# EAGLE design M900dec (EAGLE 6.6.0)
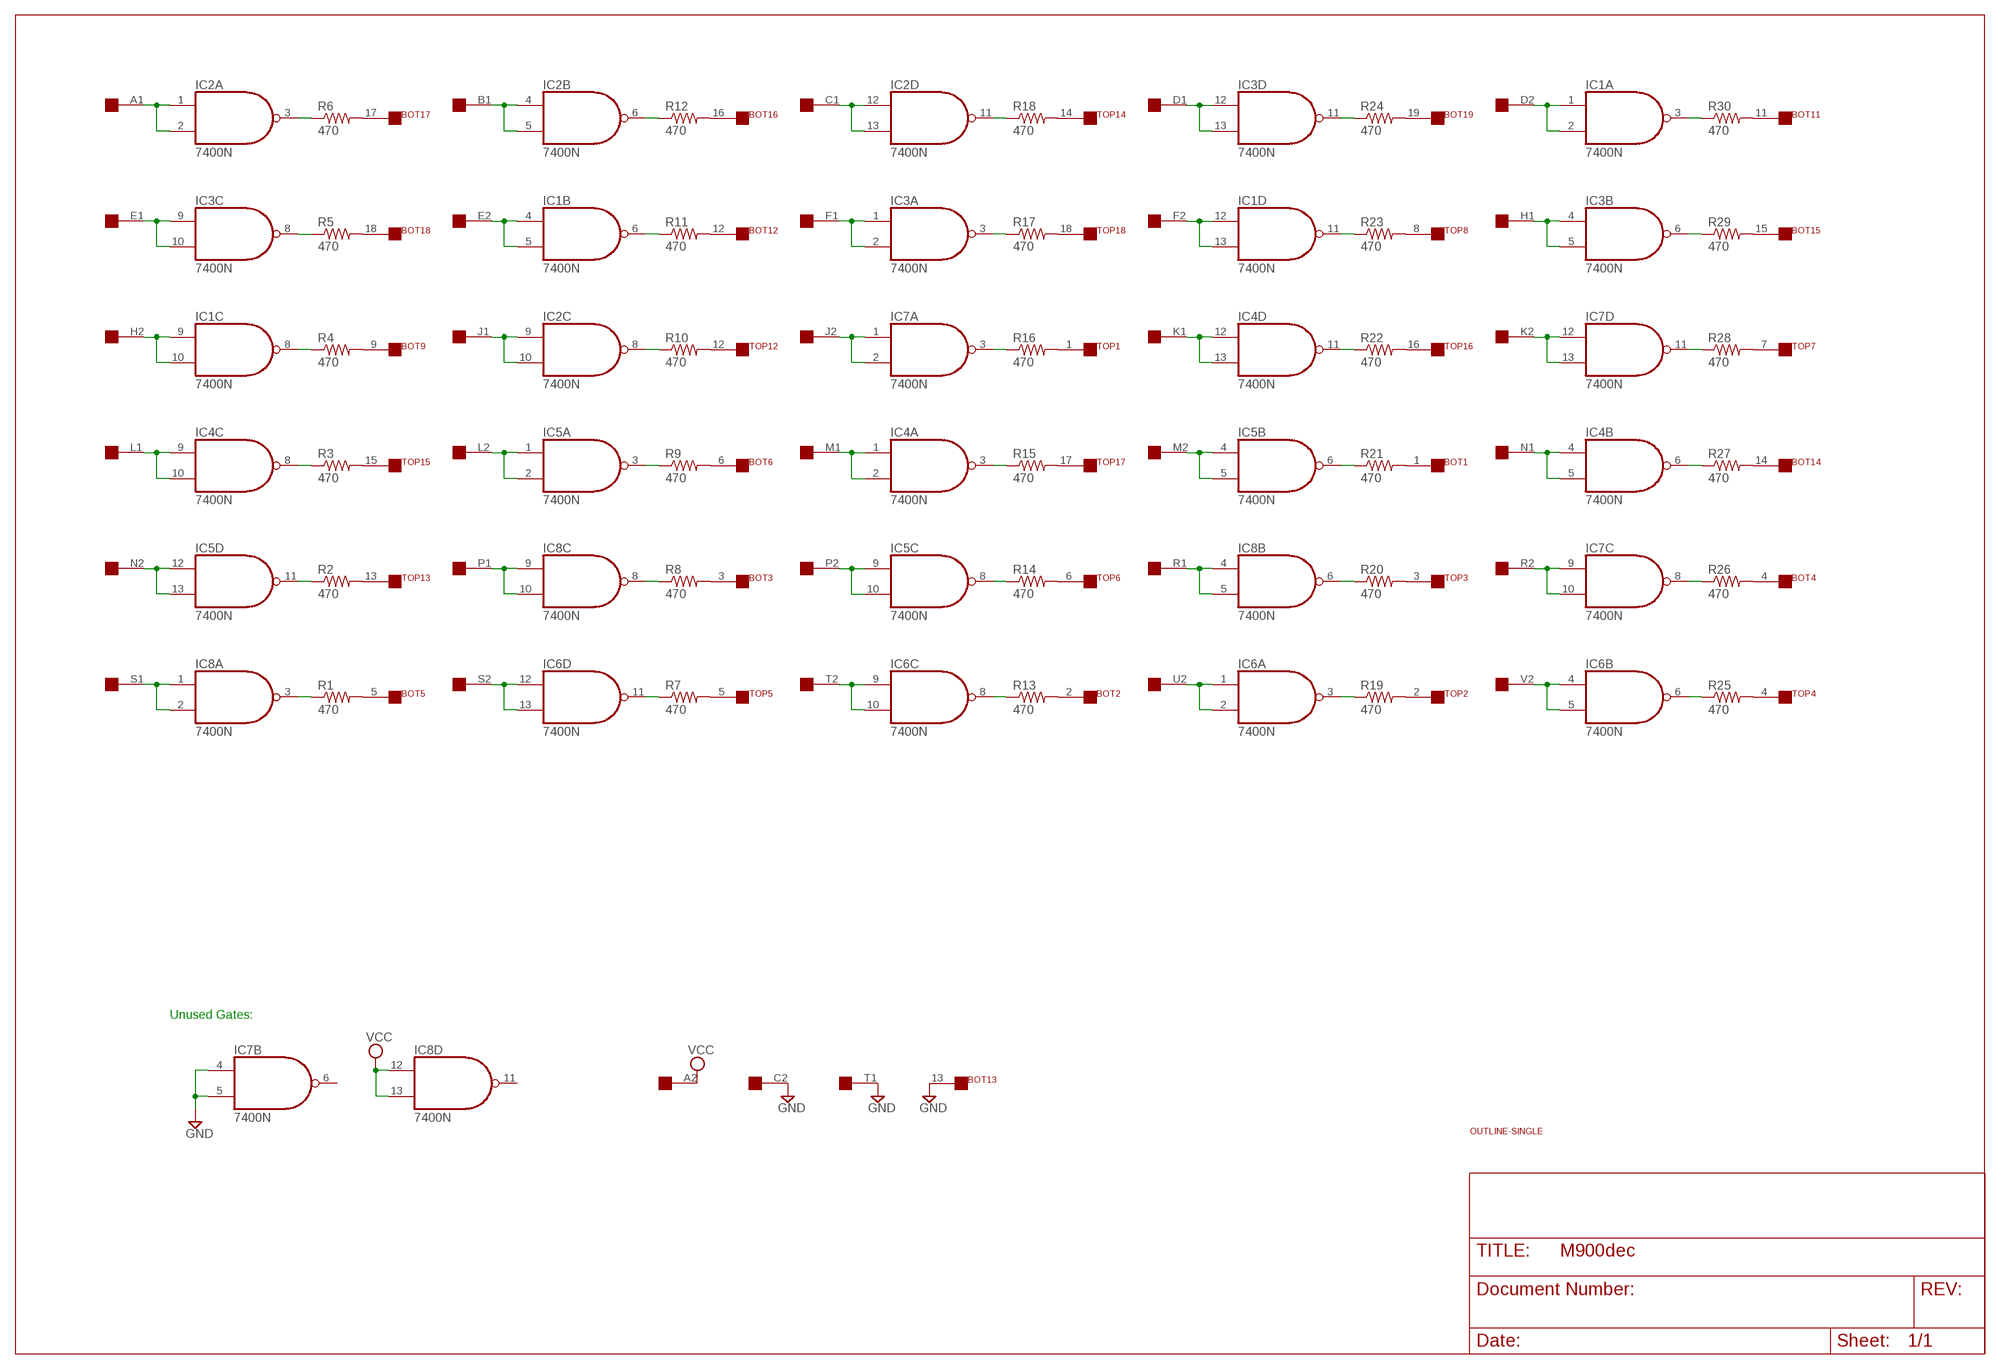
[diagram p0: schematic, sheet 1]

## Parts
BOT  FLEX19  [FLEX19]
EDGE  SINGLE  [EDGE-CON2]
IC1  7400N  [DIL14]
IC2  7400N  [DIL14]
IC3  7400N  [DIL14]
IC4  7400N  [DIL14]
IC5  7400N  [DIL14]
IC6  7400N  [DIL14]
IC7  7400N  [DIL14]
IC8  7400N  [DIL14]
R1  470  R-US_0207/10  [0207/10]
R2  470  R-US_0207/10  [0207/10]
R3  470  R-US_0207/10  [0207/10]
R4  470  R-US_0207/10  [0207/10]
R5  470  R-US_0207/10  [0207/10]
R6  470  R-US_0207/10  [0207/10]
R7  470  R-US_0207/10  [0207/10]
R8  470  R-US_0207/10  [0207/10]
R9  470  R-US_0207/10  [0207/10]
R10  470  R-US_0207/10  [0207/10]
R11  470  R-US_0207/10  [0207/10]
R12  470  R-US_0207/10  [0207/10]
R13  470  R-US_0207/10  [0207/10]
R14  470  R-US_0207/10  [0207/10]
R15  470  R-US_0207/10  [0207/10]
R16  470  R-US_0207/10  [0207/10]
R17  470  R-US_0207/10  [0207/10]
R18  470  R-US_0207/10  [0207/10]
R19  470  R-US_0207/10  [0207/10]
R20  470  R-US_0207/10  [0207/10]
R21  470  R-US_0207/10  [0207/10]
R22  470  R-US_0207/10  [0207/10]
R23  470  R-US_0207/10  [0207/10]
R24  470  R-US_0207/10  [0207/10]
R25  470  R-US_0207/10  [0207/10]
R26  470  R-US_0207/10  [0207/10]
R27  470  R-US_0207/10  [0207/10]
R28  470  R-US_0207/10  [0207/10]
R29  470  R-US_0207/10  [0207/10]
R30  470  R-US_0207/10  [0207/10]
TOP  FLEX19  [FLEX19]
U$2  OUTLINE-SINGLE  [SINGLE]

## Nets
GND: BOT.13 EDGE.C2 EDGE.T1 IC7.4(B:I0) IC7.5(B:I1)
N$1: EDGE.A1 IC2.1(A:I0) IC2.2(A:I1)
N$2: IC2.3(A:O) R6.1
N$3: IC3.8(C:O) R5.1
N$4: IC1.8(C:O) R4.1
N$5: IC4.8(C:O) R3.1
N$6: IC5.11(D:O) R2.1
N$7: EDGE.H2 IC1.9(C:I0) IC1.10(C:I1)
N$8: EDGE.S1 IC8.1(A:I0) IC8.2(A:I1)
N$9: EDGE.N2 IC5.12(D:I0) IC5.13(D:I1)
N$10: EDGE.L1 IC4.9(C:I0) IC4.10(C:I1)
N$11: EDGE.E1 IC3.9(C:I0) IC3.10(C:I1)
N$12: EDGE.P1 IC8.9(C:I0) IC8.10(C:I1)
N$13: EDGE.B1 IC2.4(B:I0) IC2.5(B:I1)
N$14: EDGE.E2 IC1.4(B:I0) IC1.5(B:I1)
N$15: EDGE.J1 IC2.9(C:I0) IC2.10(C:I1)
N$16: EDGE.L2 IC5.1(A:I0) IC5.2(A:I1)
N$17: EDGE.S2 IC6.12(D:I0) IC6.13(D:I1)
N$18: IC8.8(C:O) R8.1
N$19: IC5.3(A:O) R9.1
N$20: IC2.8(C:O) R10.1
N$21: IC1.6(B:O) R11.1
N$22: IC2.6(B:O) R12.1
N$23: IC6.11(D:O) R7.1
N$24: IC8.3(A:O) R1.1
N$25: EDGE.P2 IC5.9(C:I0) IC5.10(C:I1)
N$26: EDGE.C1 IC2.12(D:I0) IC2.13(D:I1)
N$27: EDGE.F1 IC3.1(A:I0) IC3.2(A:I1)
N$28: EDGE.J2 IC7.1(A:I0) IC7.2(A:I1)
N$29: EDGE.M1 IC4.1(A:I0) IC4.2(A:I1)
N$30: EDGE.T2 IC6.9(C:I0) IC6.10(C:I1)
N$31: IC6.8(C:O) R13.1
N$32: IC5.8(C:O) R14.1
N$33: IC4.3(A:O) R15.1
N$34: IC7.3(A:O) R16.1
N$35: IC2.11(D:O) R18.1
N$36: IC3.3(A:O) R17.1
N$37: IC6.3(A:O) R19.1
N$38: IC8.6(B:O) R20.1
N$39: IC5.6(B:O) R21.1
N$40: IC4.11(D:O) R22.1
N$41: IC1.11(D:O) R23.1
N$42: IC3.11(D:O) R24.1
N$43: EDGE.R1 IC8.4(B:I0) IC8.5(B:I1)
N$44: EDGE.F2 IC1.12(D:I0) IC1.13(D:I1)
N$45: EDGE.K1 IC4.12(D:I0) IC4.13(D:I1)
N$46: EDGE.M2 IC5.4(B:I0) IC5.5(B:I1)
N$47: EDGE.U2 IC6.1(A:I0) IC6.2(A:I1)
N$48: EDGE.R2 IC7.9(C:I0) IC7.10(C:I1)
N$49: EDGE.D1 IC3.12(D:I0) IC3.13(D:I1)
N$50: EDGE.D2 IC1.1(A:I0) IC1.2(A:I1)
N$51: EDGE.H1 IC3.4(B:I0) IC3.5(B:I1)
N$52: EDGE.K2 IC7.12(D:I0) IC7.13(D:I1)
N$53: EDGE.N1 IC4.4(B:I0) IC4.5(B:I1)
N$54: EDGE.V2 IC6.4(B:I0) IC6.5(B:I1)
N$55: IC6.6(B:O) R25.1
N$56: IC7.8(C:O) R26.1
N$57: IC4.6(B:O) R27.1
N$58: IC7.11(D:O) R28.1
N$59: IC3.6(B:O) R29.1
N$60: IC1.3(A:O) R30.1
N$61: R17.2 TOP.18
N$62: R15.2 TOP.17
N$63: R22.2 TOP.16
N$64: R3.2 TOP.15
N$65: R18.2 TOP.14
N$66: R2.2 TOP.13
N$67: R10.2 TOP.12
N$68: R23.2 TOP.8
N$69: R28.2 TOP.7
N$70: R14.2 TOP.6
N$71: R7.2 TOP.5
N$72: R25.2 TOP.4
N$73: R20.2 TOP.3
N$74: R19.2 TOP.2
N$75: R16.2 TOP.1
N$76: BOT.15 R29.2
N$77: BOT.3 R8.2
N$78: BOT.1 R21.2
N$79: BOT.2 R13.2
N$80: BOT.4 R26.2
N$81: BOT.5 R1.2
N$82: BOT.19 R24.2
N$83: BOT.18 R5.2
N$84: BOT.17 R6.2
N$85: BOT.16 R12.2
N$86: BOT.14 R27.2
N$87: BOT.12 R11.2
N$88: BOT.9 R4.2
N$89: BOT.6 R9.2
N$90: BOT.11 R30.2
VCC: EDGE.A2 IC8.12(D:I0) IC8.13(D:I1)
Unconnected: BOT.7 BOT.8 BOT.10 EDGE.B2 EDGE.U1 EDGE.V1 IC7.6(B:O) IC8.11(D:O) TOP.9 TOP.10 TOP.11 TOP.19

## Notes on the sheet
- Unused Gates:

## Power pins joined to a net without a drawn wire
GND: IC1.7(P:GND) IC2.7(P:GND) IC3.7(P:GND) IC4.7(P:GND) IC5.7(P:GND) IC6.7(P:GND) IC7.7(P:GND) IC8.7(P:GND)
VCC: IC1.14(P:VCC) IC2.14(P:VCC) IC3.14(P:VCC) IC4.14(P:VCC) IC5.14(P:VCC) IC6.14(P:VCC) IC7.14(P:VCC) IC8.14(P:VCC)

## Library data of the parts
BOT TOP = dec-con:FLEX19: 19 pin Flexprint Connection
EDGE = dec-con:SINGLE: Single-Height DEC board
IC1-IC8 = 74xx-us:74*00: Quad 2-input NAND gate
R1-R30 = rcl:R-US_: RESISTOR, American symbol
U$2 = dec-con:OUTLINE-*: Board outlines for DEC boards.

## Net classes
1 Supply: width 0.762 mm

## Board
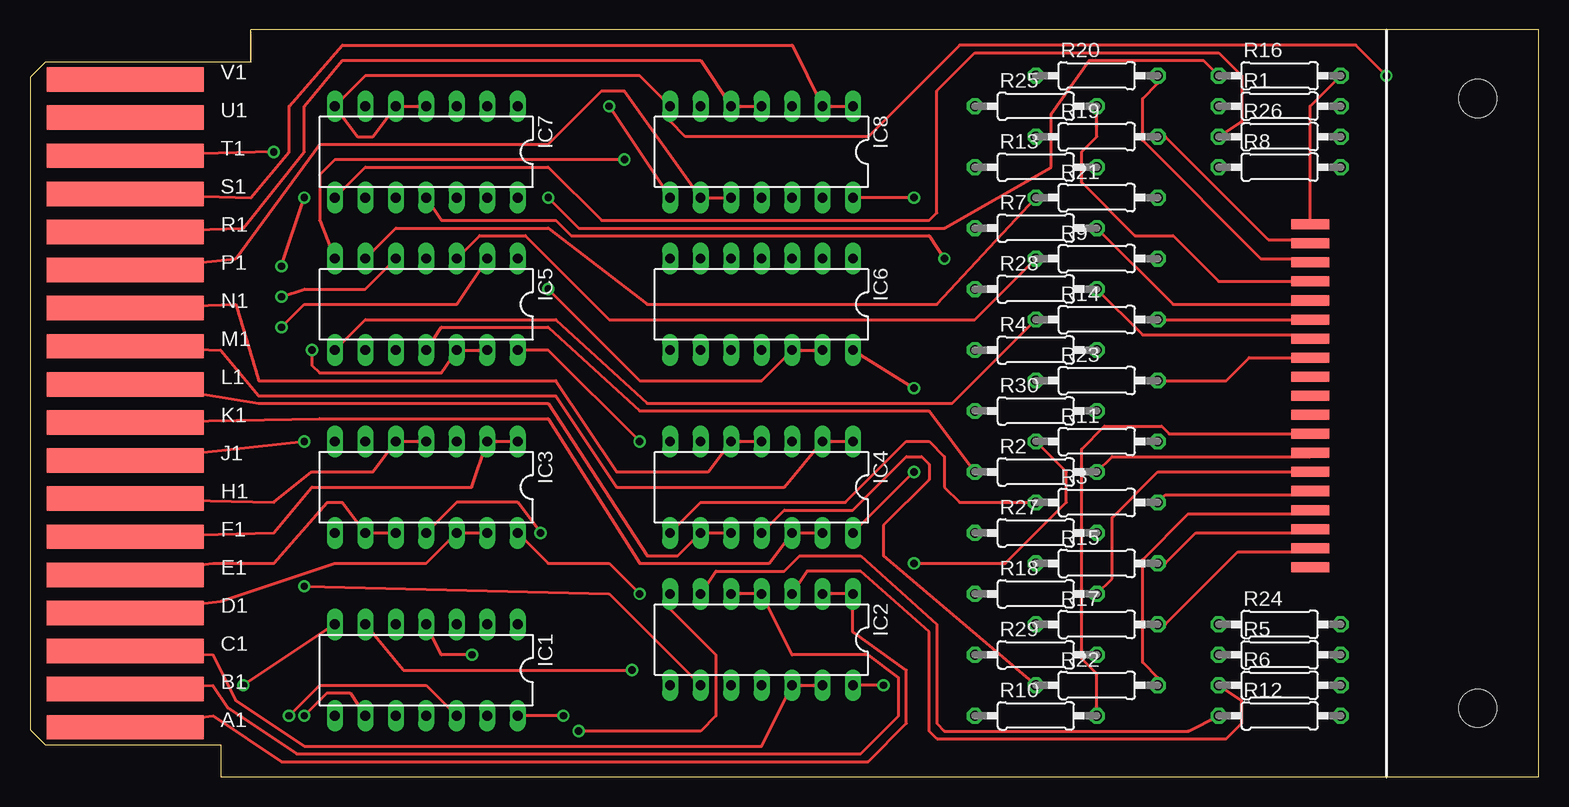
[diagram p1: board, top side]
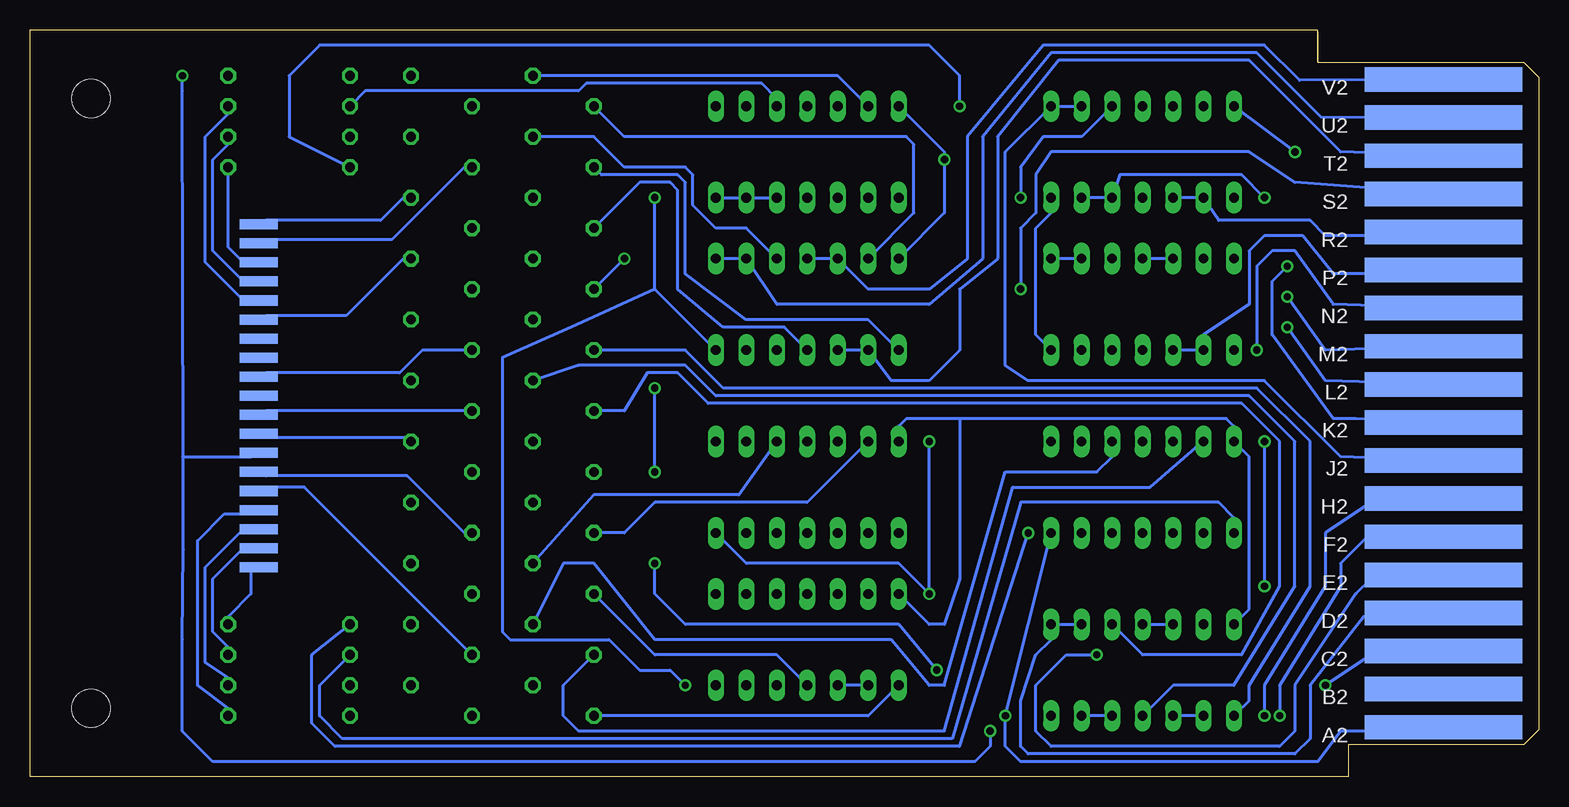
[diagram p2: board, bottom side, seen from below]

Size 125.73 x 62.23 mm. Coordinates in mm from the lower left corner, seen from the top.
Copper layers (1*16): Top 0.035mm / dielectric 1.5mm / Bottom 0.035mm
Design rules "10mils *": minimum track width 10mil, minimum drill 24mil, track to track 10mil, track to pad 10mil, pad to pad 10mil, via to via 10mil, smd to smd 10mil, copper to edge 15mil, drill to drill 10mil, minimum pad ring 10mil, minimum via ring 8mil, stop-mask expansion 0mil, vias tented up to drill 0mil, thermal gap 10mil

### Footprints (pad centres in the part's own frame; a part is rotated, then mirrored left to right if it is on the bottom)
FLEX19 = smd 3.175 x 0.838: 1 0,14.287; 2 0,12.7; 3 0,11.113; 4 0,9.525; 5 0,7.938; 6 0,6.35; 7 0,4.763; 8 0,3.175; 9 0,1.587; 10 0,0; 11 0,-1.587; 12 0,-3.175; 13 0,-4.763; 14 0,-6.35; 15 0,-7.938; 16 0,-9.525; 17 0,-11.113; 18 0,-12.7; 19 0,-14.287
EDGE-CON2 = smd 13.106 x 2.032: A1 7.938,4.128; B1 7.938,7.303; C1 7.938,10.477; D1 7.938,13.652; E1 7.938,16.828; F1 7.938,20.003; H1 7.938,23.177; J1 7.938,26.352; K1 7.938,29.527; L1 7.938,32.703; M1 7.938,35.877; N1 7.938,39.053; P1 7.938,42.227; R1 7.938,45.403; S1 7.938,48.578; T1 7.938,51.752; U1 7.938,54.928; V1 7.938,58.102 | smd 13.106 x 2.032 bottom: A2 7.938,4.128; B2 7.938,7.303; C2 7.938,10.477; D2 7.938,13.652; E2 7.938,16.828; F2 7.938,20.003; H2 7.938,23.177; J2 7.938,26.352; K2 7.938,29.527; L2 7.938,32.703; M2 7.938,35.877; N2 7.938,39.053; P2 7.938,42.227; R2 7.938,45.403; S2 7.938,48.578; T2 7.938,51.752; U2 7.938,54.928; V2 7.938,58.102
DIL14 = drill 0.813 long: 1 -7.62,-3.81; 2 -5.08,-3.81; 3 -2.54,-3.81; 4 0,-3.81; 5 2.54,-3.81; 6 5.08,-3.81; 7 7.62,-3.81; 8 7.62,3.81; 9 5.08,3.81; 10 2.54,3.81; 11 0,3.81; 12 -2.54,3.81; 13 -5.08,3.81; 14 -7.62,3.81
0207/10 = drill 0.813 octagon: 1 -5.08,0; 2 5.08,0
SINGLE = hole 3.175: 120.65,56.515; 120.65,5.715

### Placement (x,y rotation side)
BOT  106.68,31.75 0 bottom
EDGE  0,0 0 top
IC1  33.02,8.89 180 top
IC2  60.96,11.43 180 top
IC3  33.02,24.13 180 top
IC4  60.96,24.13 180 top
IC5  33.02,39.37 180 top
IC6  60.96,39.37 180 top
IC7  33.02,52.07 180 top
IC8  60.96,52.07 180 top
R1  104.14,55.88 0 top
R2  83.82,25.4 0 top
R3  88.9,22.86 0 top
R4  83.82,35.56 0 top
R5  104.14,10.16 0 top
R6  104.14,7.62 0 top
R7  83.82,45.72 0 top
R8  104.14,50.8 0 top
R9  88.9,43.18 0 top
R10  83.82,5.08 0 top
R11  88.9,27.94 0 top
R12  104.14,5.08 0 top
R13  83.82,50.8 0 top
R14  88.9,38.1 0 top
R15  88.9,17.78 0 top
R16  104.14,58.42 0 top
R17  88.9,12.7 0 top
R18  83.82,15.24 0 top
R19  88.9,53.34 0 top
R20  88.9,58.42 0 top
R21  88.9,48.26 0 top
R22  88.9,7.62 0 top
R23  88.9,33.02 0 top
R24  104.14,12.7 0 top
R25  83.82,55.88 0 top
R26  104.14,53.34 0 top
R27  83.82,20.32 0 top
R28  83.82,40.64 0 top
R29  83.82,10.16 0 top
R30  83.82,30.48 0 top
TOP  106.68,31.75 0 top
U$2  0,0 0 top

### Tracks (layer width: path | path; a pad name or v marks a point on that pad's centre or on a via)
GND  (via drill 0.61)
  Top 0.254: v17.78,7.62 IC1.7 | v20.32,52.07 EDGE.T1 | IC7.4 IC7.5 28.58,53.34 27.31,53.34 IC7.7 27.94,58.42 50.8,58.42 IC8.7 53.34,54.61 54.61,53.34 69.85,53.34 77.47,60.96 110.49,60.96 v113.03,58.42 | IC5.7 24.13,46.35 24.13,50.16 25.4,51.44 v49.53,51.44 | v45.72,3.81 55.88,3.81 57.15,5.08 57.15,10.16 53.34,13.97 IC2.7
  Bottom 0.254: v17.78,7.62 13.97,10.16 EDGE.C2 | IC1.7 24.13,13.97 24.13,26.67 IC3.7 25.4,29.21 26.04,29.84 48.26,29.84 | IC7.7 v20.32,52.07 | 48.26,29.84 52.71,29.84 53.34,29.21 IC4.7 | IC2.7 50.8,12.7 49.53,12.7 48.26,16.51 48.26,29.84 | IC6.7 49.53,46.99 v49.53,51.44 49.53,52.07 IC8.7 | v45.72,3.81 45.72,2.54 46.99,1.27 110.49,1.27 113.03,3.81 113.03,11.43 112.95,18.95 112.97,26.67 | v113.03,58.42 113.03,57.15 112.97,26.67 | BOT.13 107.32,26.67 113.03,26.67 112.97,26.67
N$1
  Top 0.254: EDGE.A1 15.24,5.08 20.96,1.27 69.85,1.27 73.03,4.45 73.03,8.89 68.58,12.06 IC2.1 IC2.2
N$2
  Top 0.254: IC2.3 64.77,17.14 69.22,17.14 74.93,12.06 74.93,3.81 75.57,3.17 99.7,3.17 100.97,4.45 100.97,6.35 R6.1
N$3
  Bottom 0.254: IC3.8 25.4,21.59 26.67,22.86 43.18,22.86 48.9,3.17 99.7,3.17 101.6,5.08 101.6,7.62 R5.1
N$4
  Bottom 0.254: IC1.8 24.13,6.35 24.13,7.62 19.05,15.88 19.05,27.94 23.5,32.38 67.95,32.38 71.12,35.56 R4.1
N$5
  Top 0.254: IC4.8 55.88,22.86 67.95,22.86 73.03,27.94 74.93,27.94 76.2,26.67 76.2,24.13 77.47,22.86 R3.1
N$6
  Top 0.254: IC5.11 34.29,37.47 43.18,37.47 50.8,30.48 74.93,30.48 R2.1
N$7  (via drill 0.61)
  Top 0.254: v22.86,5.08 24.77,6.99 26.67,6.99 IC1.9
  Bottom 0.254: EDGE.H2 13.97,22.86 17.78,20.32 17.78,15.88 22.86,7.62 v22.86,5.08 | IC1.9 IC1.10
N$8
  Top 0.254: EDGE.S1 18.42,48.26 21.59,52.07 21.59,55.88 26.04,60.96 63.5,60.96 IC8.2 IC8.1
N$9  (via drill 0.61)
  Top 0.254: IC5.13 IC5.12 34.29,33.66 24.13,33.66 23.5,34.29 v23.5,35.56
  Bottom 0.254: EDGE.N2 17.15,39.37 20.32,43.81 22.23,43.81 23.5,42.55 v23.5,35.56
N$10
  Top 0.254: IC4.10 IC4.9 53.98,18.41 51.44,18.41 43.18,31.11 19.05,31.11 7.62,33.02 EDGE.L1
N$11
  Top 0.254: IC3.10 IC3.9 26.04,22.86 24.77,22.86 20.32,17.78 15.24,17.78 EDGE.E1
N$12
  Top 0.254: IC8.10 IC8.9 49.53,57.15 47.63,57.15 43.18,52.7 24.13,52.7 17.15,43.18 EDGE.P1
N$13
  Top 0.254: EDGE.B1 15.24,7.62 16.51,5.71 22.23,1.91 69.22,1.91 72.39,5.08 72.39,8.26 69.85,10.16 63.5,10.16 IC2.4 IC2.5
N$14  (via drill 0.61)
  Top 0.254: v36.83,10.16 34.29,10.16 IC1.4
  Bottom 0.254: EDGE.E2 13.97,16.51 15.24,15.24 20.32,7.62 20.32,3.81 21.59,2.54 40.64,2.54 41.91,3.81 41.91,7.62 39.37,10.16 v36.83,10.16 | IC1.4 IC1.5
N$15  (via drill 0.61)
  Top 0.254: EDGE.J1 v22.86,27.94 | v22.86,15.88 48.26,15.24 IC2.9
  Bottom 0.254: v22.86,27.94 v22.86,15.88 | IC2.9 IC2.10
N$16  (via drill 0.61)
  Top 0.254: v20.96,37.47 22.86,39.37 35.56,39.37 IC5.2
  Bottom 0.254: EDGE.L2 17.78,33.02 v20.96,37.47 | IC5.2 IC5.1
N$17  (via drill 0.61)
  Top 0.254: v43.18,40.64 50.8,33.02 60.96,33.02 IC6.12 IC6.13
  Bottom 0.254: EDGE.S2 20.32,49.53 24.13,52.07 40.64,52.07 41.91,50.16 41.91,46.99 43.18,45.72 v43.18,40.64
N$18  (via drill 0.61)
  Top 0.254: IC8.8 v48.26,55.88
  Bottom 0.254: v48.26,55.88 48.26,58.42 50.8,60.96 101.6,60.96 104.14,58.42 104.14,53.34 R8.1
N$19
  Top 0.254: IC5.3 37.47,45.09 41.28,45.09 48.26,38.1 78.74,38.1 R9.1
N$20
  Bottom 0.254: IC2.8 55.88,5.08 R10.1
N$21  (via drill 0.61)
  Top 0.254: IC1.6 31.12,8.89 v50.17,8.89 | v73.66,17.78 81.28,17.78 86.36,22.86 86.36,25.4 R11.1
  Bottom 0.254: v50.17,8.89 53.34,12.7 71.12,12.7 73.66,15.24 v73.66,17.78
N$22
  Top 0.254: IC2.6 57.15,17.14 62.87,17.14 64.14,18.41 69.22,18.41 75.57,12.7 75.57,4.45 76.2,3.81 96.52,3.81 R12.1
N$23
  Bottom 0.254: IC6.11 62.87,37.47 67.95,37.47 71.76,40.64 71.76,48.9 72.39,49.53 74.93,49.53 R7.1
N$24
  Bottom 0.254: IC8.3 63.5,56.52 64.77,57.78 79.38,57.78 80.01,57.15 97.79,57.15 R1.1
N$25
  Bottom 0.254: EDGE.P2 13.97,41.91 17.15,41.91 19.69,45.09 22.86,45.09 24.13,43.81 24.13,39.37 27.94,36.83 IC5.9 IC5.10
N$26
  Top 0.254: EDGE.C1 15.24,10.16 17.15,6.35 22.86,2.54 60.96,2.54 IC2.12 IC2.13
N$27
  Top 0.254: IC3.1 IC3.2 36.83,24.13 23.5,24.13 20.32,20.32 EDGE.F1
N$28
  Bottom 0.254: EDGE.J2 16.51,26.67 22.86,33.02 42.55,33.02 44.45,34.29 44.45,52.07 IC7.1 IC7.2
N$29
  Top 0.254: EDGE.M1 15.88,35.56 19.05,31.75 43.82,31.75 48.9,24.13 62.87,24.13 IC4.2 IC4.1
N$30
  Bottom 0.254: EDGE.T2 16.51,52.07 24.13,59.69 40.01,59.69 45.09,53.34 45.09,43.18 48.26,40.64 48.26,35.56 50.8,33.02 53.98,33.02 IC6.9 IC6.10
N$31
  Bottom 0.254: IC6.8 55.88,38.1 66.04,38.1 71.12,41.91 71.12,49.53 71.76,50.16 78.11,50.16 R13.1
N$32
  Top 0.254: IC5.8 27.94,38.1 43.82,38.1 51.44,31.11 76.84,31.11 R14.1
N$33
  Bottom 0.254: IC4.3 66.68,23.5 78.74,23.5 R15.1
N$34  (via drill 0.61)
  Top 0.254: v43.18,48.26 45.72,45.72 76.2,45.72 85.09,50.8 85.09,55.24 88.27,59.69 97.79,59.69 R16.1
  Bottom 0.254: IC7.3 38.1,53.34 41.28,53.34 43.18,50.8 v43.18,48.26
N$35
  Bottom 0.254: IC2.11 63.5,10.16 73.66,10.16 R18.1
N$36
  Bottom 0.254: IC3.3 35.56,26.67 36.83,25.4 44.45,25.4 49.53,7.62 50.8,7.62 53.98,11.43 73.66,11.43 78.74,17.78 81.28,17.78 R17.1
N$37
  Bottom 0.254: IC6.3 66.04,45.72 68.58,45.72 70.49,47.62 70.49,50.16 71.12,50.8 76.2,50.8 78.74,53.34 R19.1
N$38
  Bottom 0.254: IC8.6 58.42,58.42 R20.1
N$39
  Top 0.254: IC5.6 30.48,45.72 43.18,45.72 51.44,39.37 75.57,39.37 R21.1
N$40
  Top 0.254: IC4.11 62.87,22.23 68.58,22.23 73.03,26.67 74.3,26.67 74.93,26.04 74.93,24.77 71.12,20.95 71.12,18.41 R22.1
N$41
  Bottom 0.254: IC1.11 30.48,7.62 25.4,7.62 20.32,15.88 20.32,27.94 24.13,31.75 68.58,31.75 71.12,34.29 80.01,34.29 R23.1
N$42  (via drill 0.61)
  Top 0.254: IC3.11 35.56,22.86 40.64,22.86 v42.55,20.32
  Bottom 0.254: v42.55,20.32 48.26,2.54 100.33,2.54 102.24,4.45 102.24,10.16 R24.1
N$43
  Top 0.254: EDGE.R1 17.78,45.72 22.86,52.07 22.86,55.88 26.04,59.69 55.88,59.69 IC8.5 IC8.4
N$44  (via drill 0.61)
  Top 0.254: IC1.12 33.02,7.62 24.13,7.62 v21.59,5.08
  Bottom 0.254: EDGE.F2 13.97,20.32 16.51,17.78 16.51,15.88 21.59,7.62 v21.59,5.08 | IC1.12 IC1.13
N$45
  Top 0.254: EDGE.K1 24.13,29.84 43.18,29.84 50.8,17.78 61.6,17.78 IC4.12 IC4.13
N$46  (via drill 0.61)
  Top 0.254: v20.96,40.01 22.86,40.64 27.94,40.64 IC5.5
  Bottom 0.254: EDGE.M2 17.78,35.56 v20.96,40.01 | IC5.5 IC5.4
N$47
  Bottom 0.254: EDGE.U2 18.14,54.97 23.5,60.33 40.64,60.33 46.36,53.34 46.36,43.18 50.8,39.37 63.5,39.37 IC6.2 IC6.1
N$48
  Bottom 0.254: EDGE.R2 13.97,45.09 17.78,45.09 19.05,46.35 26.67,46.35 IC7.9 IC7.10
N$49
  Top 0.254: IC3.13 IC3.12 33.02,17.78 25.4,17.78 15.88,14.61 EDGE.D1
N$50
  Bottom 0.254: EDGE.D2 13.34,13.34 14.61,13.34 19.05,7.62 19.05,3.17 20.32,1.91 42.55,1.91 43.18,2.54 43.18,6.35 41.91,10.16 40.64,11.43 IC1.1 IC1.2
N$51
  Top 0.254: EDGE.H1 20.32,22.86 23.5,25.4 28.58,25.4 IC3.5 IC3.4
N$52  (via drill 0.61)
  Top 0.254: v20.96,42.55 v22.86,48.26
  Bottom 0.254: IC7.13 IC7.12 34.93,50.16 24.77,50.16 v22.86,48.26 | EDGE.K2 15.24,29.84 17.15,29.84 22.23,36.83 22.23,41.27 v20.96,42.55
N$53
  Top 0.254: EDGE.N1 17.15,39.37 19.05,33.02 43.82,33.02 48.9,25.4 56.52,25.4 IC4.5 IC4.4
N$54
  Bottom 0.254: EDGE.V2 19.93,58.03 22.86,60.96 41.28,60.96 47.63,53.34 47.63,43.18 50.8,40.64 55.88,40.64 IC6.5 IC6.4
N$55
  Bottom 0.254: IC6.6 52.07,46.99 52.07,52.7 52.71,53.34 76.2,53.34 R25.1
N$56
  Top 0.254: IC7.8 27.94,50.8 43.18,50.8 47.63,46.35 74.93,46.35 75.57,46.99 75.57,57.15 78.74,60.33 99.06,60.33 100.97,58.42 100.97,54.61 R26.1
N$57
  Bottom 0.254: IC4.6 60.96,22.86 73.66,22.86 76.2,20.32 R27.1
N$58  (via drill 0.61)
  Top 0.254: IC7.11 34.29,46.35 43.82,46.35 45.09,45.09 74.93,45.09 v76.2,43.18
  Bottom 0.254: v76.2,43.18 R28.1
N$59
  Bottom 0.254: IC3.6 32.39,24.13 43.82,24.13 49.53,3.81 80.01,3.81 81.28,5.08 81.28,7.62 R29.1
N$60
  Bottom 0.254: IC1.3 33.02,10.16 24.77,10.16 21.59,15.88 21.59,27.94 24.77,31.11 69.22,31.11 71.76,33.66 74.3,33.66 76.2,30.48 R30.1
N$61
  Top 0.254: TOP.18 106.05,18.73 100.65,18.73 94.62,12.7 R17.2
N$62
  Top 0.254: TOP.17 106.05,20.32 97.16,20.32 94.62,17.78 R15.2
N$63
  Top 0.254: TOP.16 106.05,21.91 96.52,21.91 92.71,18.1 92.71,9.53 93.98,8.26 R22.2
N$64
  Top 0.254: TOP.15 106.05,23.5 94.62,23.5 R3.2
N$65
  Top 0.254: TOP.14 93.98,25.4 90.17,21.59 90.17,16.51 R18.2
N$66
  Top 0.254: R2.2 90.17,26.67 106.68,26.67 TOP.13
N$67
  Top 0.254: R10.2 88.9,8.57 87.63,9.84 87.63,27.3 89.54,29.21 94.3,29.21 94.93,28.57 TOP.12
N$68
  Top 0.254: TOP.8 101.6,34.92 99.7,33.02 R23.2
N$69
  Top 0.254: R28.2 92.71,36.83 106.68,36.83 TOP.7
N$70
  Top 0.254: R14.2 TOP.6
N$71
  Top 0.254: R7.2 95.25,39.37 106.68,39.37 TOP.5
N$72
  Top 0.254: TOP.4 99.06,41.27 95.25,45.09 92.08,45.09 87.63,49.53 87.63,52.07 88.9,53.34 R25.2
N$73
  Top 0.254: TOP.3 106.05,43.18 102.55,43.18 92.71,53.02 92.71,56.52 93.98,57.78 R20.2
N$74
  Top 0.254: TOP.2 106.05,44.77 103.19,44.77 94.62,53.34 R19.2
N$75
  Top 0.254: R16.2 106.68,55.88 TOP.1 106.68,45.72
N$76
  Bottom 0.254: R29.2 102.87,24.13 106.68,24.13 BOT.15
N$77
  Bottom 0.254: BOT.3 107.32,43.18 108.27,43.18 109.22,44.13 R8.2
N$78
  Bottom 0.254: BOT.1 106.05,46.35 96.52,46.35 94.62,48.26 R21.2
N$79
  Bottom 0.254: BOT.2 106.05,44.77 95.57,44.77 89.54,50.8 R13.2
N$80
  Bottom 0.254: BOT.4 107.32,41.59 108.27,41.59 110.49,43.81 110.49,51.44 109.22,52.7 R26.2
N$81
  Bottom 0.254: BOT.5 107.32,40.01 108.27,40.01 111.13,42.86 111.13,53.34 109.22,55.24 R1.2
N$82
  Bottom 0.254: BOT.19 107.32,17.14 107.32,15.24 109.22,13.34 R24.2
N$83
  Bottom 0.254: BOT.18 107.32,18.73 108.27,18.73 110.49,16.51 110.49,12.06 109.22,10.79 R5.2
N$84
  Bottom 0.254: 106.05,20.32 BOT.17 107.32,20.32 108.27,20.32 111.13,17.46 111.13,9.53 109.22,8.26 R6.2
N$85
  Bottom 0.254: R12.2 109.22,5.71 111.76,7.62 111.76,19.68 109.54,21.91 107.32,21.91 BOT.16
N$86
  Bottom 0.254: BOT.14 106.05,25.08 94.3,25.08 89.54,20.32 R27.2
N$87
  Bottom 0.254: BOT.12 106.05,28.26 94.3,28.26 R11.2
N$88
  Bottom 0.254: BOT.9 106.05,33.66 94.93,33.66 93.03,35.56 R4.2
N$89
  Bottom 0.254: BOT.6 106.05,38.42 99.38,38.42 94.62,43.18 R9.2
N$90
  Bottom 0.254: BOT.11 106.05,30.48 R30.2
VCC  (via drill 0.61)
  Top 0.254: v44.45,5.08 IC1.14 | IC3.14 43.18,17.78 48.26,17.78 v50.8,15.24 | v50.8,27.94 43.18,35.56 IC5.14 | IC4.14 v73.66,25.4 | v73.66,32.38 IC6.14 | v71.12,7.62 IC2.14 | v73.66,48.26 IC8.14
  Bottom 0.254: EDGE.A2 13.97,3.81 16.51,3.81 18.42,1.27 43.18,1.27 44.45,2.54 v44.45,5.08 IC3.14 | IC5.14 41.91,36.83 41.91,45.72 40.64,46.99 IC7.14 | IC4.14 66.04,17.78 53.34,17.78 v50.8,15.24 v50.8,27.94 | v73.66,25.4 v73.66,32.38 | IC8.14 IC8.13 IC8.12 | v71.12,7.62 72.39,8.89 74.93,8.89 77.47,11.43 85.73,11.43 86.36,12.06 86.36,34.92 80.65,37.47 73.66,40.64 | 73.66,40.64 v73.66,48.26 | IC6.14 73.66,40.64

### Text on the board
tPlace: Trace layout does not match DEC's!